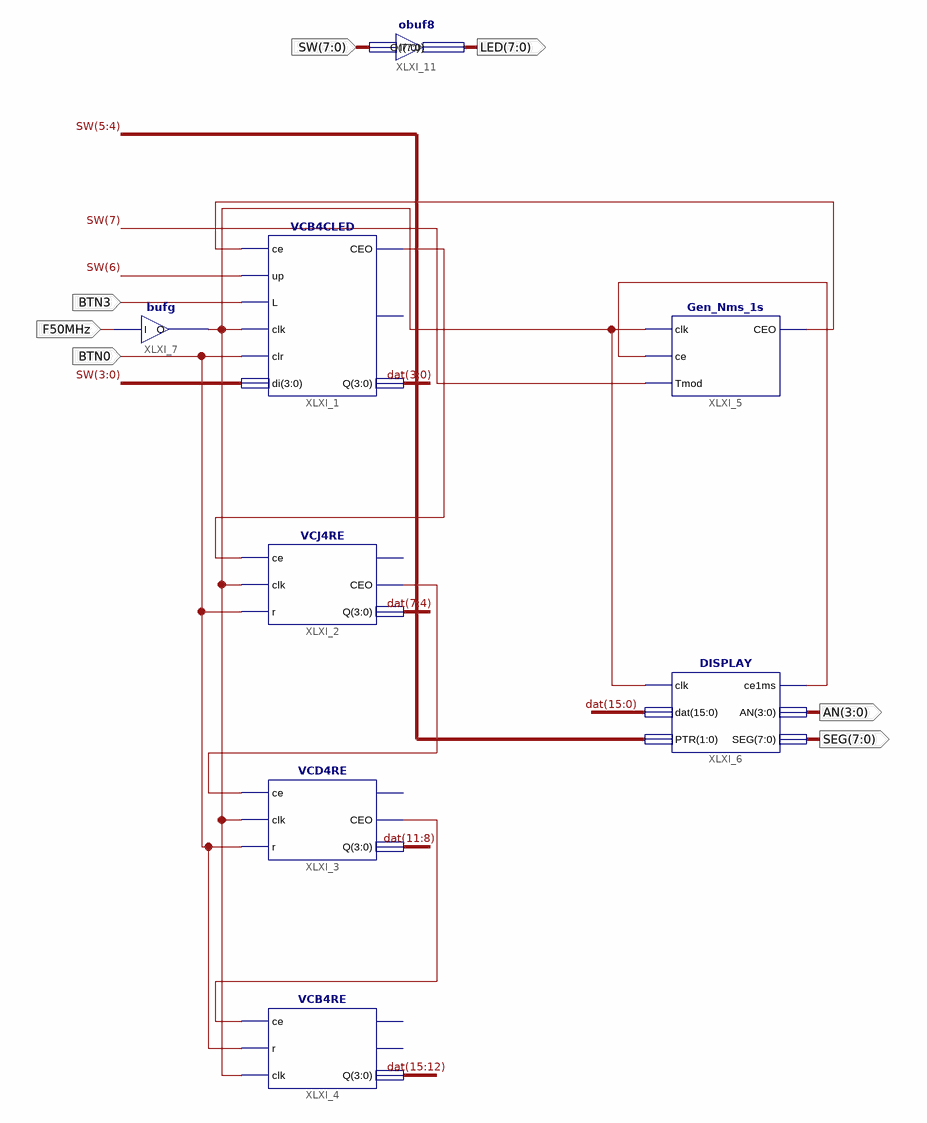
[diagram p0: schematic sheet 1]
// Xilinx ISE schematic Sch1.sch (spartan3e) as structural Verilog: 8 symbols, 7 ports
module Sch1 (
  input  BTN0,
  input  BTN3,
  input  F50MHz,
  input  [7:0] SW,
  output [3:0] AN,
  output [7:0] SEG,
  output [7:0] LED
);

  wire XLXN_7, XLXN_11, XLXN_13, XLXN_17, XLXN_18, XLXN_19;
  wire [15:0] dat;

  VCB4CLED XLXI_1 (
    .ce(XLXN_7), .up(SW[6]), .L(BTN3), .clk(XLXN_13), .clr(BTN0), .di(SW[3:0]), .CEO(XLXN_17), .Q(dat[3:0]));  // open: TC
  VCJ4RE XLXI_2 (.ce(XLXN_17), .clk(XLXN_13), .r(BTN0), .CEO(XLXN_18), .Q(dat[7:4]));  // open: TC
  VCD4RE XLXI_3 (.ce(XLXN_18), .clk(XLXN_13), .r(BTN0), .CEO(XLXN_19), .Q(dat[11:8]));  // open: TC
  VCB4RE XLXI_4 (.ce(XLXN_19), .r(BTN0), .clk(XLXN_13), .Q(dat[15:12]));  // open: TC, CEO
  Gen_Nms_1s XLXI_5 (.clk(XLXN_13), .ce(XLXN_11), .Tmod(SW[7]), .CEO(XLXN_7));
  DISPLAY XLXI_6 (.clk(XLXN_13), .dat(dat), .PTR(SW[5:4]), .ce1ms(XLXN_11), .AN(AN), .SEG(SEG));
  bufg XLXI_7 (.I(F50MHz), .O(XLXN_13));
  obuf8 XLXI_11 (.I(SW), .O(LED));
endmodule
